# Altium project addl.PrjPcb
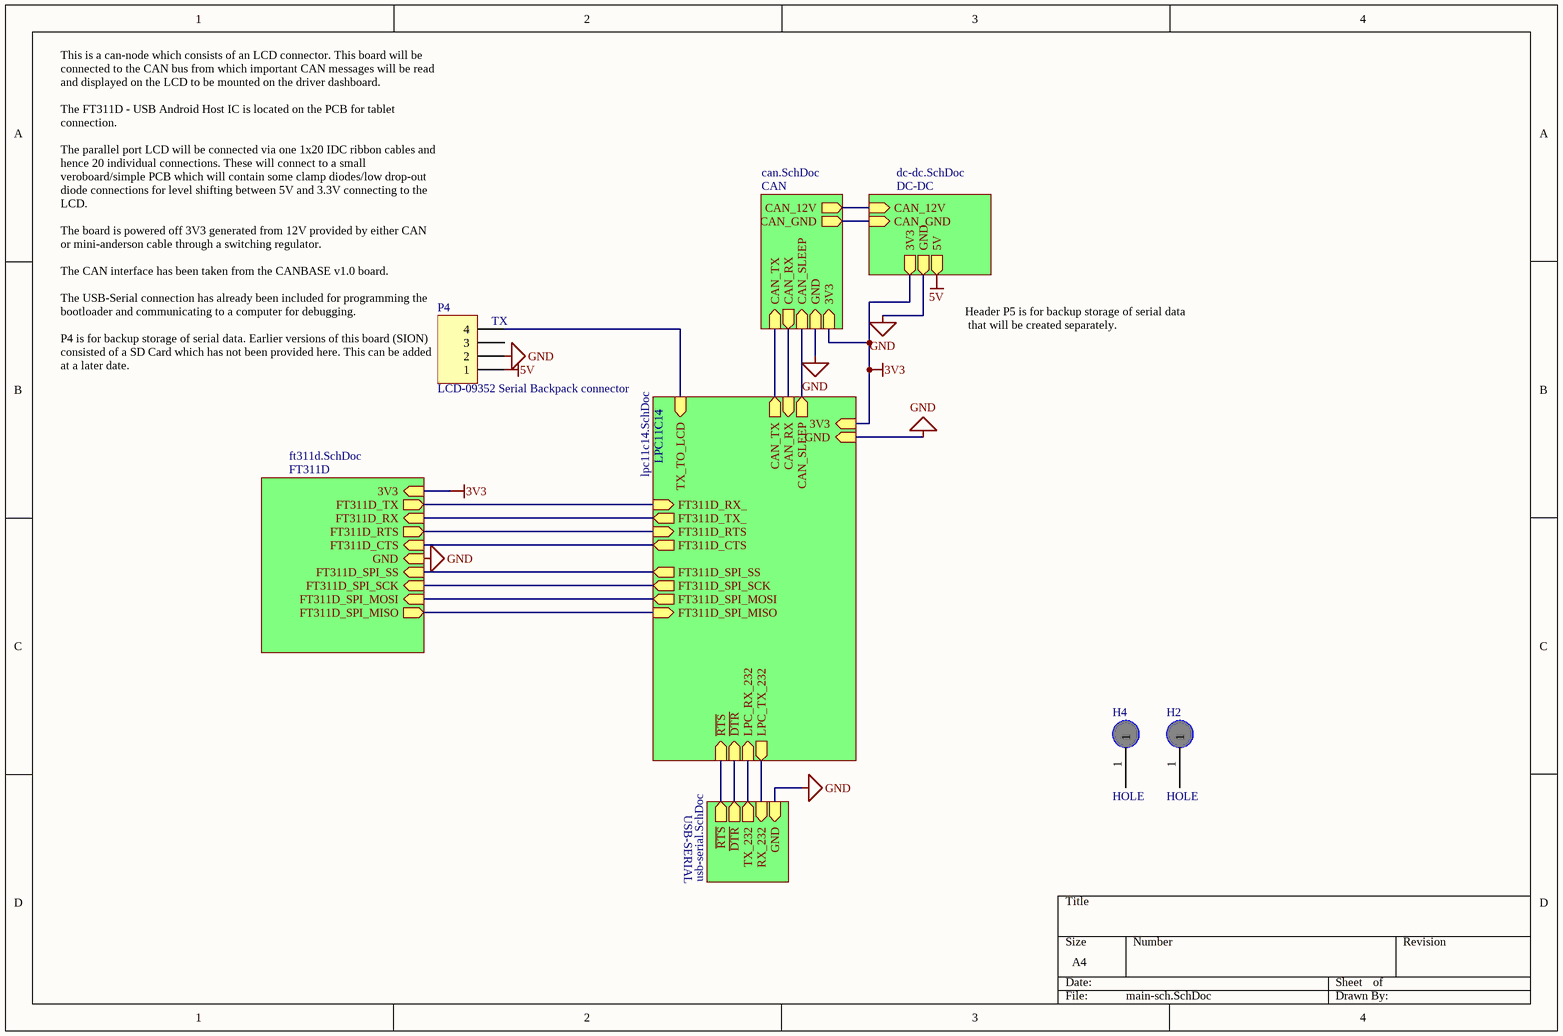
[diagram p0: main-sch.SchDoc]
6 sheets, 77 parts. Net scope: hierarchical (ports join the sheet entries above them; power ports are global).
Board files: addl.PcbDoc, addl_faceplate_left.PcbDoc, addl_faceplate_right.PcbDoc
Sheets:
  main-sch.SchDoc
    CAN = can.SchDoc
    FT311D = ft311d.SchDoc
    LPC11C14 = lpc11c14.SchDoc
    DC-DC = dc-dc.SchDoc
    USB-SERIAL = usb-serial.SchDoc

## Sheet main-sch.SchDoc
size A4

### Parts
H2  HOLE  [M2.5]
H4  HOLE  [M2.5]
P4  Header 4  [HDR1X4]  (value not drawn)

### Sub-sheets
CAN = can.SchDoc: CAN_TX (in), CAN_RX (out), 3V3 (in), GND (in), CAN_12V (out), CAN_GND (out), CAN_SLEEP (in)
DC-DC = dc-dc.SchDoc: 3V3 (out), GND (out), CAN_12V (in), 5V (out), CAN_GND (in)
FT311D = ft311d.SchDoc: FT311D_TX (out), FT311D_RX (in), FT311D_RTS (out), FT311D_CTS (in), 3V3 (in), GND (in), FT311D_SPI_SS (in), FT311D_SPI_SCK (in), FT311D_SPI_MOSI (in), FT311D_SPI_MISO (out)
LPC11C14 = lpc11c14.SchDoc: CAN_TX (out), CAN_RX (in), LPC_TX_232 (out), LPC_RX_232 (in), FT311D_RX_ (in), FT311D_TX_ (out), ~{DTR} (in), ~{RTS} (in), TX_TO_LCD (in), 3V3 (in), GND (in), FT311D_RTS (in), FT311D_CTS (out), FT311D_SPI_SS (out), FT311D_SPI_SCK (out), FT311D_SPI_MOSI (out), FT311D_SPI_MISO (in), CAN_SLEEP (out)
USB-SERIAL = usb-serial.SchDoc: RX_232 (in), TX_232 (out), ~{RTS} (out), ~{DTR} (out), GND (in)

### Nets
3V3: sheet CAN/3V3, sheet FT311D/3V3, sheet LPC11C14/3V3, sheet DC-DC/3V3
5V: P4.1 ; sheet DC-DC/5V
CAN_GND: sheet CAN/CAN_GND, sheet DC-DC/CAN_GND
GND: P4.2 ; sheet CAN/GND, sheet FT311D/GND, sheet LPC11C14/GND, sheet DC-DC/GND, sheet USB-SERIAL/GND
~{DTR}: sheet LPC11C14/~{DTR}, sheet USB-SERIAL/~{DTR}
~{RTS}: sheet LPC11C14/~{RTS}, sheet USB-SERIAL/~{RTS}
CAN_12v: sheet CAN/CAN_12V, sheet DC-DC/CAN_12V
CAN_RX: sheet CAN/CAN_RX, sheet LPC11C14/CAN_RX
CAN_TX: sheet CAN/CAN_TX, sheet LPC11C14/CAN_TX
FT311D_RX: sheet FT311D/FT311D_RX, sheet LPC11C14/FT311D_TX_
FT311D_RX_: sheet FT311D/FT311D_TX, sheet LPC11C14/FT311D_RX_
LPC_RX_232: sheet LPC11C14/LPC_RX_232, sheet USB-SERIAL/TX_232
LPC_TX_232: sheet LPC11C14/LPC_TX_232, sheet USB-SERIAL/RX_232
PIO 0.7: sheet FT311D/FT311D_CTS, sheet FT311D/FT311D_SPI_SS, sheet LPC11C14/FT311D_CTS, sheet LPC11C14/FT311D_SPI_SS
PIO 0.8/MISO0: sheet FT311D/FT311D_SPI_MISO, sheet LPC11C14/FT311D_SPI_MISO
PIO 1.5: sheet FT311D/FT311D_RTS, sheet LPC11C14/FT311D_RTS
PIO 2.1/SCK1: sheet FT311D/FT311D_SPI_SCK, sheet LPC11C14/FT311D_SPI_SCK
PIO 2.3/MOSI1: sheet FT311D/FT311D_SPI_MOSI, sheet LPC11C14/FT311D_SPI_MOSI
PIO 3.1: sheet CAN/CAN_SLEEP, sheet LPC11C14/CAN_SLEEP
TX_TO_LCD: P4.4 ; sheet LPC11C14/TX_TO_LCD

Not connected (* = marked no-connect by the designer): H2 1; H4 1; P4 3

### Notes on the sheet
- (near P4) This is a can-node which consists of an LCD connector. This board will be connected to the CAN bus from which important CAN messages will be read and displayed on the LCD to be mounted on the driver dashboard.
  The FT311D - USB Android Host IC is located on the PCB for tablet connection.
  The parallel port LCD will be connected via one 1x20 IDC ribbon cables and hence 20 individual connections. These will connect to a small veroboard/simple PCB which will contain some clamp diodes/low drop-out diode connections for level shifting between 5V and 3.3V connecting to the LCD.
  The board is powered off 3V3 generated from 12V provided by either CAN or mini-anderson cable through a switching regulator.
  The CAN interface has been taken from the CANBASE v1.0 board.
  The USB-Serial connection has already been included for programming the bootloader and communicating to a computer for debugging.
  P4 is for backup storage of serial data. Earlier versions of this board (SION) consisted of a SD Card which has not been provided here. This can be added at a later date.
- (near P4) TX
- Header P5 is for backup storage of serial data
  that will be created separately.
- (near P4) LCD-09352 Serial Backpack connector

### Library data of the parts
P4 = Header 4: Header, 4-Pin; LatestRevisionDate: 17-Jul-2002; LatestRevisionNote: Re-released for DXP Platform.; Publisher: Altium Limited

## Sheet can.SchDoc
size A4
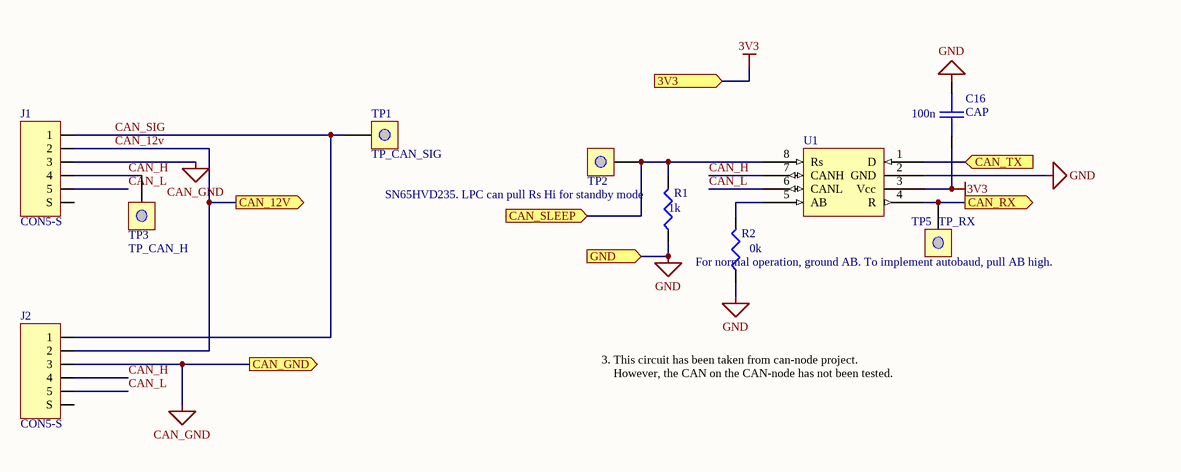
[diagram p1: can.SchDoc]

### Parts
C16  CAP  value 100n  [0603]
J1  CON5-S  [TRIAD5F]
J2  CON5-S  [TRIAD5F]
R1  value 1k  [0603]  (hidden comment: RES1)
R2  For normal operation, ground AB. To implement autobaud, pull AB high.  value 0k  [0603]
TP1  TP_CAN_SIG  [TESTPOINT]
TP2  TEST  [TESTPOINT]  (value not drawn)
TP3  TP_CAN_H  [TESTPOINT]
TP5  TP_RX  [TESTPOINT]
U1  SN65HVD235. LPC can pull Rs Hi for standby mode  [SO8]

### Ports
3V3 (in), CAN_12V (out), CAN_GND (out), CAN_RX (out), CAN_SLEEP (in), CAN_TX (in), GND (in)

### Nets
3V3: C16.2 U1.3(Vcc) ; port 3V3
CAN_GND: J1.3 J2.3 ; port CAN_GND
GND: C16.1 R1.1 R2.1 U1.2(GND) ; port GND
CAN_12v: J1.2 J2.2 ; port CAN_12V
CAN_H: J1.4 J2.4 TP3.0(TP) U1.7(CANH)
CAN_L: J1.5 J2.5 U1.6(CANL)
CAN_RX: TP5.0(TP) U1.4(R) ; port CAN_RX
CAN_SIG: J1.1 J2.1 TP1.0(TP)
CAN_TX: U1.1(D) ; port CAN_TX
PIO 3.1: R1.2 TP2.0(TP) U1.8(Rs) ; port CAN_SLEEP
NetR2_2: R2.2 U1.5(AB)

Not connected (* = marked no-connect by the designer): J1 0(S); J2 0(S)

### Notes on the sheet
- 3. This circuit has been taken from can-node project.
  However, the CAN on the CAN-node has not been tested.

### Library data of the parts
C16 = CAP: Capacitor
J1 J2 = CON5-S: Connector, 2 pin, with shield @ S
R1 R2 = RES1: Resistor
TP1 = TEST: TEST POINT for 12V on CAN
TP2 TP3 TP5 = TEST: TEST POINT
U1 = SN65HVD235: 3.3V CAN XCVR W/STANDBY

## Sheet ft311d.SchDoc
size A4
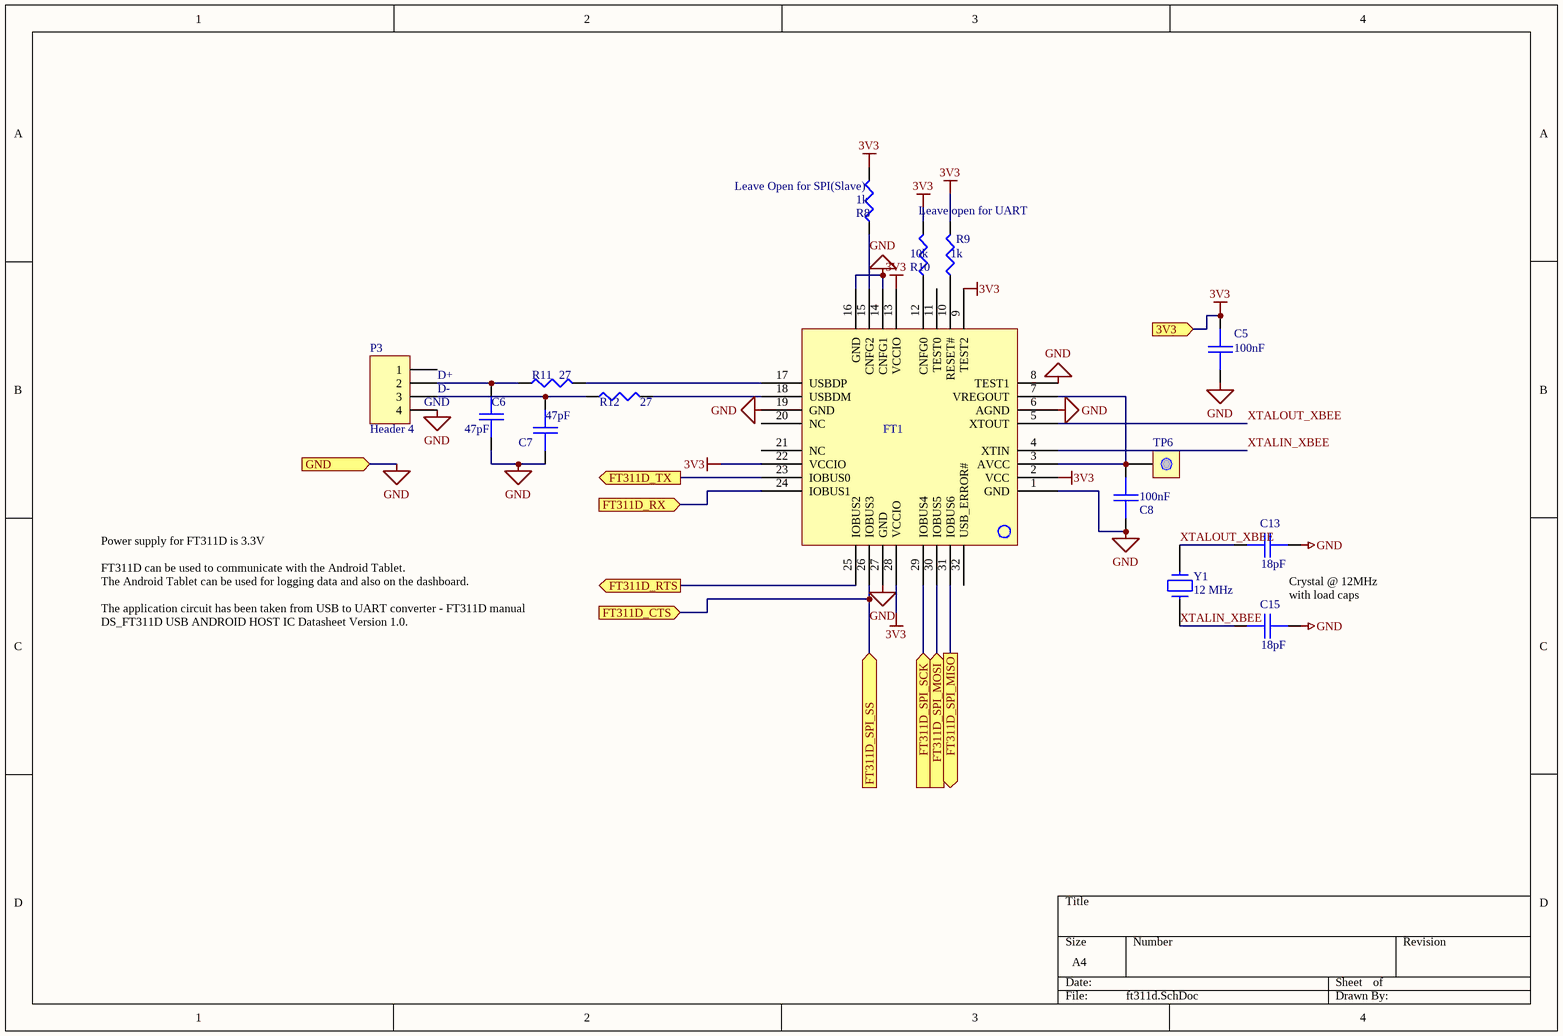
[diagram p2: ft311d.SchDoc]

### Parts
C5  value 100nF  [0603]  (hidden comment: CAP)
C6  value 47pF  [0603]  (hidden comment: CAP)
C7  value 47pF  [0603]  (hidden comment: CAP)
C8  value 100nF  [0603]  (hidden comment: CAP)
C13  value 18pF  [0603]  (hidden comment: CAP)
C15  value 18pF  [0603]  (hidden comment: CAP)
FT1  FT311D  [QFP32]  (value not drawn)
P3  Header 4  [HDR1X4]
R8  Leave Open for SPI(Slave)  value 1k  [0603]
R9  value 1k  [0603]  (hidden comment: RES1)
R10  Leave open for UART  value 10k  [0603]
R11  27  [0603]
R12  value 27  [0603]  (hidden comment: RES1)
TP6  TP_AVCC  [TESTPOINT]  (value not drawn)
Y1  12 MHz  [HC49/4H]

### Ports
3V3 (in), FT311D_CTS (in), FT311D_RTS (out), FT311D_RX (in), FT311D_SPI_MISO (out), FT311D_SPI_MOSI (in), FT311D_SPI_SCK (in), FT311D_SPI_SS (in), FT311D_TX (out), GND (in)

### Nets
3V3: C5.1 FT1.2(VCC) FT1.9(TEST2) FT1.13(VCCIO) FT1.22(VCCIO) FT1.28(VCCIO) R8.2 R9.2 R10.2 ; port 3V3
GND: C5.2 C6.2 C7.2 C8.2 C13.2 C15.2 FT1.1(GND) FT1.6(AGND) FT1.8(TEST1) FT1.14(CNFG1) FT1.16(GND) FT1.19(GND) FT1.27(GND) P3.4 ; port GND
FT311D_RX: FT1.24(IOBUS1) ; port FT311D_RX
FT311D_RX_: FT1.23(IOBUS0) ; port FT311D_TX
PIO 0.7: FT1.26(IOBUS3) ; port FT311D_CTS, port FT311D_SPI_SS
PIO 0.8/MISO0: FT1.31(IOBUS6) ; port FT311D_SPI_MISO
PIO 1.5: FT1.25(IOBUS2) ; port FT311D_RTS
PIO 2.1/SCK1: FT1.29(IOBUS4) ; port FT311D_SPI_SCK
PIO 2.3/MOSI1: FT1.30(IOBUS5) ; port FT311D_SPI_MOSI
XTALIN_XBEE: C15.1 FT1.4(XTIN) Y1.1
XTALOUT_XBEE: C13.1 FT1.5(XTOUT) Y1.2
NetC6_1: C6.1 P3.2 R11.1
NetC7_1: C7.1 P3.3 R12.1
NetC8_1: C8.1 FT1.3(AVCC) FT1.7(VREGOUT) TP6.0(TP)
NetFT1_10: FT1.10(RESET#) R9.1
NetFT1_12: FT1.12(CNFG0) R10.1
NetFT1_15: FT1.15(CNFG2) R8.1
NetFT1_17: FT1.17(USBDP) R11.2
NetFT1_18: FT1.18(USBDM) R12.2

Not connected (* = marked no-connect by the designer): FT1 11(TEST0) 20(NC) 21(NC) 32(USB_ERROR#); P3 1

### Notes on the sheet
- D+
- (near P3) GND
- D-
- Power supply for FT311D is 3.3V
  FT311D can be used to communicate with the Android Tablet.
  The Android Tablet can be used for logging data and also on the dashboard.
  The application circuit has been taken from USB to UART converter - FT311D manual
  DS_FT311D USB ANDROID HOST IC Datasheet Version 1.0.
- Crystal @ 12MHz with load caps

### Library data of the parts
C5 C8 C13 C15 = CAP: Capacitor
C6 C7 = CAP1: Capacitor
FT1 = FT311D: USB ANDROID Host IC; Manufacturer Part No: FT311D-32L1C-R-IC; Digital IC Case Style: LQFP; Farnell (09/02/2013): $6.08
P3 = Header 4: Header, 4-Pin; LatestRevisionDate: 17-Jul-2002; LatestRevisionNote: Re-released for DXP Platform.; Publisher: Altium Limited
R8-R12 = RES1: Resistor
  R11: Value: 27
TP6 = TEST: TEST POINT
Y1 = CRYSTAL: Needed?: RS; RS: 693-8803; RS Price: 0.95

## Sheet lpc11c14.SchDoc
size A4
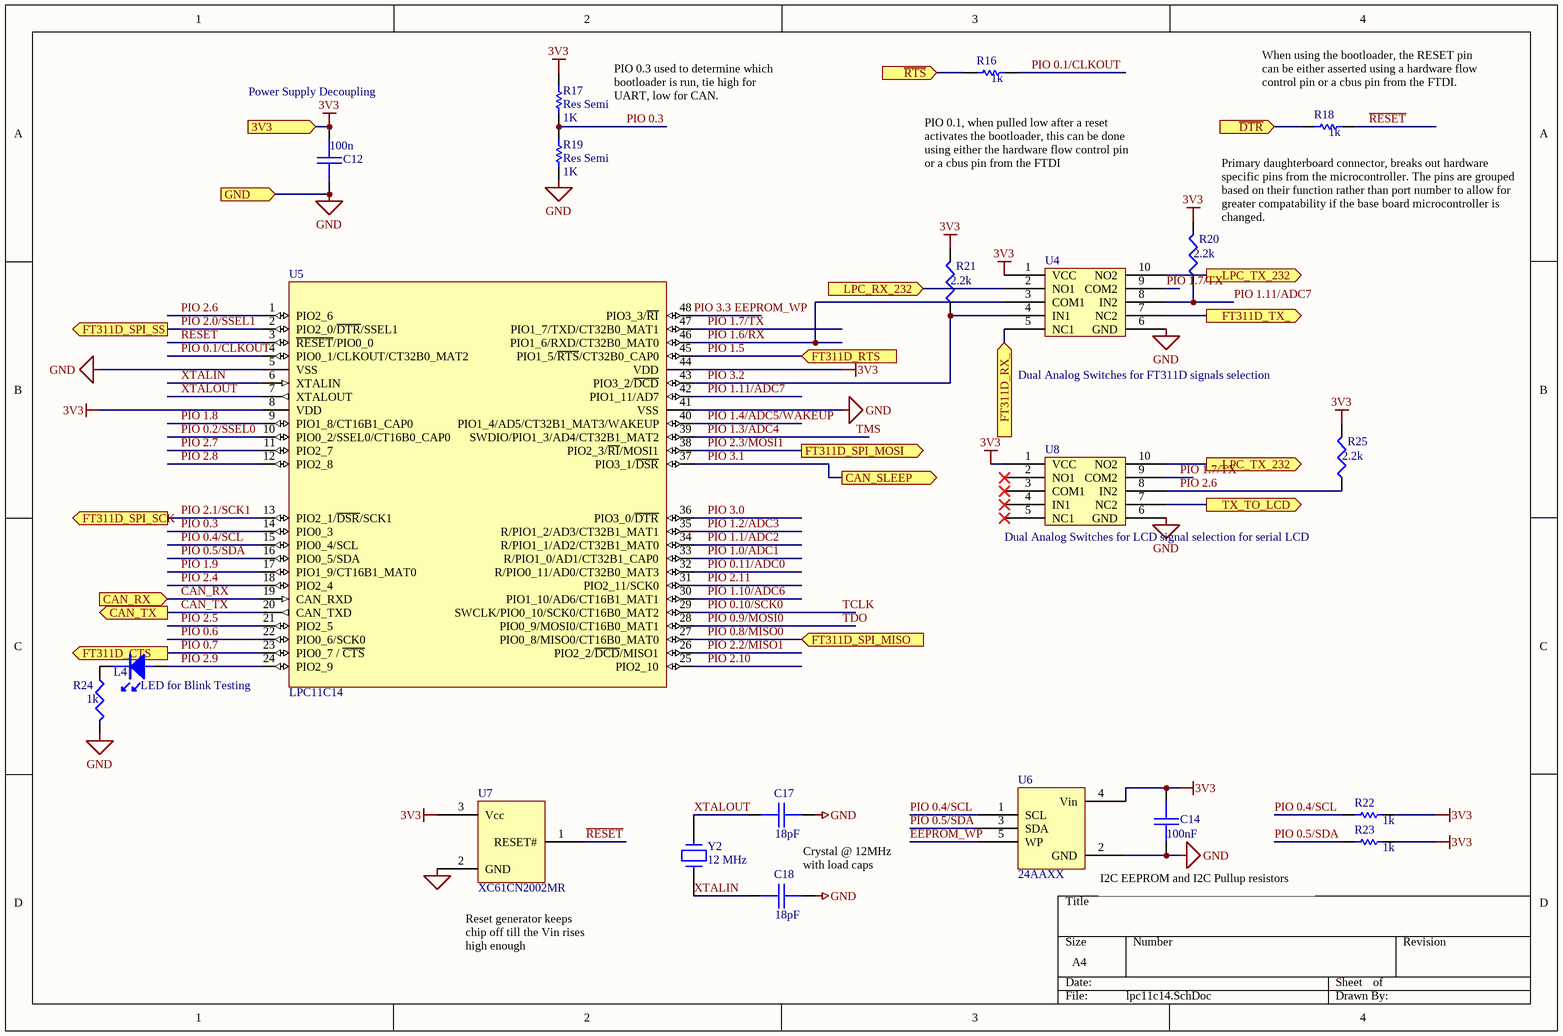
[diagram p3: lpc11c14.SchDoc]

### Parts
C12  value 100n  [0603]  (hidden comment: CAP)
C14  value 100nF  [0603]  (hidden comment: CAP)
C17  value 18pF  [0603]  (hidden comment: CAP)
C18  value 18pF  [0603]  (hidden comment: CAP)
L4  LED for Blink Testing  [0805LED]
R16  value 1k  [0603]  (hidden comment: Res Semi)
R17  Res Semi  value 1K  [0603]
R18  value 1k  [0603]  (hidden comment: Res Semi)
R19  Res Semi  value 1K  [0603]
R20  value 2.2k  [0603]  (hidden comment: RES1)
R21  value 2.2k  [0603]  (hidden comment: RES1)
R22  value 1k  [0603]  (hidden comment: Res Semi)
R23  value 1k  [0603]  (hidden comment: Res Semi)
R24  value 1k  [0603]  (hidden comment: RES1)
R25  value 2.2k  [0603]  (hidden comment: RES1)
U4  Dual Analog Switches for FT311D signals selection  [Micro10]
U5  LPC11C14  [QFP48]
U6  24AAXX  [SOT23-5]
U7  XC61CN2002MR  [SOT23-3]
U8  Dual Analog Switches for LCD signal selection for serial LCD  [Micro10]
Y2  12 MHz  [HC49/4H]

### Ports
3V3 (in), CAN_RX (in), CAN_SLEEP (out), CAN_TX (out), FT311D_CTS (out), FT311D_RTS (in), FT311D_RX_ (in), FT311D_SPI_MISO (in), FT311D_SPI_MOSI (out), FT311D_SPI_SCK (out), FT311D_SPI_SS (out), FT311D_TX_ (out), GND (in), LPC_RX_232 (in), LPC_TX_232 (out), TX_TO_LCD (out), ~{DTR} (in), ~{RTS} (in)

### Nets
3V3: C12.1 C14.1 R17.2 R20.2 R21.2 R22.2 R23.2 R25.2 U4.1(VCC) U5.8(VDD) U5.44(VDD) U6.4(Vin) U7.3(Vcc) U8.1(VCC) ; port 3V3
GND: C12.2 C14.2 C17.2 C18.2 R19.1 R24.2 U4.6(GND) U5.5(VSS) U5.41(VSS) U6.2(GND) U7.2(GND) U8.6(GND) ; port GND
~{DTR}: R18.1 ; port ~{DTR}
~{RTS}: R16.1 ; port ~{RTS}
CAN_RX: U5.19(CAN_RXD) ; port CAN_RX
CAN_TX: U5.20(CAN_TXD) ; port CAN_TX
EEPROM_WP: U5.48(PIO3_3/~{RI}) U6.5(WP)  [also labelled PIO 3.3]
FT311D_RX: U4.7(NC2) ; port FT311D_TX_
FT311D_RX_: U4.5(NC1) ; port FT311D_RX_
LPC_RX_232: U4.2(NO1) ; port LPC_RX_232
LPC_TX_232: U4.10(NO2) U8.10(NO2) ; port LPC_TX_232
PIO 0.1/CLKOUT: R16.2 U5.4(PIO0_1/CLKOUT/CT32B0_MAT2)
PIO 0.2/SSEL0: U5.10(PIO0_2/SSEL0/CT16B0_CAP0)
PIO 0.3: R17.1 R19.2 U5.14(PIO0_3)
PIO 0.4/SCL: R22.1 U5.15(PIO0_4/SCL) U6.1(SCL)
PIO 0.5/SDA: R23.1 U5.16(PIO0_5/SDA) U6.3(SDA)
PIO 0.6: U5.22(PIO0_6/SCK0)
PIO 0.7: U5.2(PIO2_0/~{DTR}/SSEL1) U5.23(PIO0_7_/_~{CTS}) ; port FT311D_CTS, port FT311D_SPI_SS  [also labelled PIO 2.0/SSEL1]
PIO 0.8/MISO0: U5.27(PIO0_8/MISO0/CT16B0_MAT0) ; port FT311D_SPI_MISO
PIO 0.9/MOSI0: U5.28(PIO0_9/MOSI0/CT16B0_MAT1)  [also labelled TDO]
PIO 0.10/SCK0: U5.29(SWCLK/PIO0_10/SCK0/CT16B0_MAT2)  [also labelled TCLK]
PIO 0.11/ADC0: U5.32(R/PIO0_11/AD0/CT32B0_MAT3)
PIO 1.0/ADC1: U5.33(R/PIO1_0/AD1/CT32B1_CAP0)
PIO 1.1/ADC2: U5.34(R/PIO1_1/AD2/CT32B1_MAT0)
PIO 1.2/ADC3: U5.35(R/PIO1_2/AD3/CT32B1_MAT1)
PIO 1.3/ADC4: U5.39(SWDIO/PIO1_3/AD4/CT32B1_MAT2)  [also labelled TMS]
PIO 1.4/ADC5/WAKEUP: U5.40(PIO1_4/AD5/CT32B1_MAT3/WAKEUP)
PIO 1.5: U5.45(PIO1_5/~{RTS}/CT32B0_CAP0) ; port FT311D_RTS
PIO 1.6/RX: U4.3(COM1) U5.46(PIO1_6/RXD/CT32B0_MAT0)
PIO 1.7/TX: U4.9(COM2) U5.47(PIO1_7/TXD/CT32B0_MAT1) U8.9(COM2)
PIO 1.8: U5.9(PIO1_8/CT16B1_CAP0)
PIO 1.9: U5.17(PIO1_9/CT16B1_MAT0)
PIO 1.10/ADC6: U5.30(PIO1_10/AD6/CT16B1_MAT1)
PIO 1.11/ADC7: R20.1 U4.8(IN2) U5.42(PIO1_11/AD7)
PIO 2.1/SCK1: U5.13(PIO2_1/~{DSR}/SCK1) ; port FT311D_SPI_SCK
PIO 2.2/MISO1: U5.26(PIO2_2/~{DCD}/MISO1)
PIO 2.3/MOSI1: U5.38(PIO2_3/~{RI}/MOSI1) ; port FT311D_SPI_MOSI
PIO 2.4: U5.18(PIO2_4)
PIO 2.5: U5.21(PIO2_5)
PIO 2.6: R25.1 U5.1(PIO2_6) U8.8(IN2)
PIO 2.7: U5.11(PIO2_7)
PIO 2.8: U5.12(PIO2_8)
PIO 2.9: L4.A U5.24(PIO2_9)
PIO 2.10: U5.25(PIO2_10)
PIO 2.11: U5.31(PIO2_11/SCK0)
PIO 3.0: U5.36(PIO3_0/~{DTR})
PIO 3.1: U5.37(PIO3_1/~{DSR}) ; port CAN_SLEEP
PIO 3.2: R21.1 U4.4(IN1) U5.43(PIO3_2/~{DCD})
~{RESET}: R18.2 U5.3(~{RESET}/PIO0_0) U7.1(RESET#)
TX_TO_LCD: U8.7(NC2) ; port TX_TO_LCD
XTALIN: C18.1 U5.6(XTALIN) Y2.1
XTALOUT: C17.1 U5.7(XTALOUT) Y2.2
NetL4_K: L4.K R24.1

Not connected (* = marked no-connect by the designer): U8 2(NO1)* 3(COM1)* 4(IN1)* 5(NC1)*

### Notes on the sheet
- (near C12) Power Supply Decoupling
- PIO 0.3 used to determine which bootloader is run, tie high for UART, low for CAN.
- (near R18) When using the bootloader, the RESET pin can be either asserted using a hardware flow control pin or a cbus pin from the FTDI.
- Text
- (near R16) PIO 0.1, when pulled low after a reset activates the bootloader, this can be done using either the hardware flow control pin or a cbus pin from the FTDI
- Primary daughterboard connector, breaks out hardware specific pins from the microcontroller. The pins are grouped based on their function rather than port number to allow for greater compatability if the base board microcontroller is changed.
- Crystal @ 12MHz with load caps
- I2C EEPROM and I2C Pullup resistors
- (near U7) Reset generator keeps chip off till the Vin rises high enough

### Library data of the parts
C12 C14 C17 C18 = CAP: Capacitor
L4 = LED
R16-R19 R22 R23 = Res Semi: Semiconductor Resistor; Published: 8-Jun-2000; LatestRevisionDate: 17-Jul-2002; LatestRevisionNote: Re-released for DXP Platform.; PackageReference: AXIAL-0.5; Publisher: Altium Limited; PackageDescription: Axial Device, Thru-Hole; 2 Leads; 0.5 in Pin Spacing
R20 R21 R24 R25 = RES1: Resistor
U4 U8 = NLAS4684: Ultra-low resistance dual SPDT Analog switch
U5 = LPC11C14_Full: NXP LPC11C14 Microcontroller; Farnell: NA
U6 = 24AAXX: I2C EEPROM for SOT23-5 package
U7 = XC61F: SOT23 reset generator; Needed?: Farnell; Farnell: 3605486; Farnell Price: 1.74
Y2 = CRYSTAL: as Y1 on sheet ft311d

## Sheet dc-dc.SchDoc
size A4
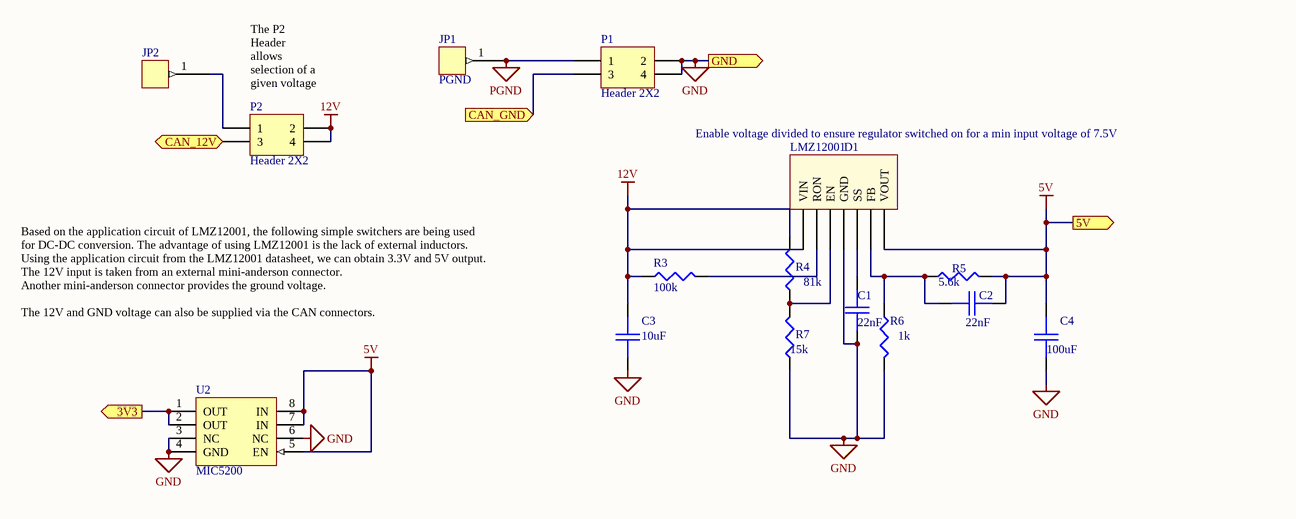
[diagram p4: dc-dc.SchDoc]

### Parts
C1  value 22nF  [0603]  (hidden comment: CAP)
C2  value 22nF  [0603]  (hidden comment: CAP)
C3  value 10uF  [1206]  (hidden comment: CAP)
C4  value 100uF  [1206]  (hidden comment: CAP)
D1  DC-DC SWITCHER  [PFM-7]  (value not drawn)
JP1  PGND  [POWERPOLE25A]
JP2  CON1  [POWERPOLE25A]  (value not drawn)
P1  Header 2X2  [HDR2X2]
P2  Header 2X2  [HDR2X2]
R3  value 100k  [0603]  (hidden comment: RES1)
R4  value 81k  [0603]  (hidden comment: RES1)
R5  value 5.6k  [0603]  (hidden comment: RES1)
R6  value 1k  [0603]  (hidden comment: RES1)
R7  value 15k  [0603]  (hidden comment: RES1)
U2  MIC5200  [SO8]

### Ports
3V3 (out), 5V (out), CAN_12V (in), CAN_GND (in), GND (out)

### Nets
3V3: U2.1(OUT) U2.2(OUT) ; port 3V3
5V: C2.2 C4.1 D1.7(VOUT) R5.2 U2.5(EN) U2.7(IN) U2.8(IN) ; port 5V
12V: C3.1 D1.1(VIN) P2.2 P2.4 R3.1 R4.2
CAN_GND: P1.3 ; port CAN_GND
GND: C1.2 C3.2 C4.2 D1.4(GND) P1.2 P1.4 R6.2 R7.1 U2.3(NC) U2.4(GND) U2.6(NC) ; port GND
PGND: JP1.1 P1.1
CAN_12v: P2.3 ; port CAN_12V
NetC1_1: C1.1 D1.5(SS)
NetC2_1: C2.1 D1.6(FB) R5.1 R6.1
NetD1_2: D1.2(RON) R3.2
NetD1_3: D1.3(EN) R4.1 R7.2
NetJP2_1: JP2.1 P2.1

### Notes on the sheet
- (near P2) The P2 Header allows selection of a given voltage
- Enable voltage divided to ensure regulator switched on for a min input voltage of 7.5V
- LMZ12001
- Based on the application circuit of LMZ12001, the following simple switchers are being used
  for DC-DC conversion. The advantage of using LMZ12001 is the lack of external inductors.
  Using the application circuit from the LMZ12001 datasheet, we can obtain 3.3V and 5V output.
  The 12V input is taken from an external mini-anderson connector.
  Another mini-anderson connector provides the ground voltage.
  The 12V and GND voltage can also be supplied via the CAN connectors.

### Library data of the parts
C1-C4 = CAP: Capacitor
D1 = lmz12001
JP1 = CON1: Power Ground (currently assumed that it is provided through a min-anderson connector)
JP2 = CON1: Currently assumed that the mini-anderson connector provides 12V
P1 P2 = Header 2X2: Header, 2-Pin, Dual row; LatestRevisionDate: 17-Jul-2002; LatestRevisionNote: Re-released for DXP Platform.; Publisher: Altium Limited
R3-R7 = RES1: Resistor
U2 = MIC5200: MIC5200 - SO8

## Sheet usb-serial.SchDoc
size A4
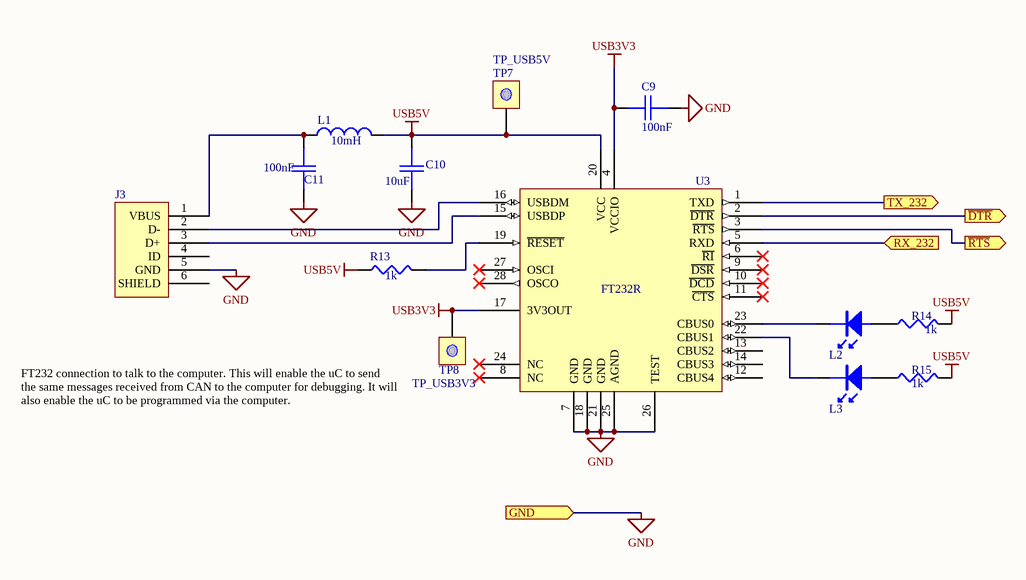
[diagram p5: usb-serial.SchDoc]

### Parts
C9  value 100nF  [0603]  (hidden comment: CAP)
C10  value 10uF  [0603]  (hidden comment: CAP)
C11  value 100nF  [0603]  (hidden comment: CAP)
J3  USB_MINIB  [USBMINIB]  (value not drawn)
L1  value 10mH  [1812]  (hidden comment: INDUCTOR)
L2  LED  [0805LED]  (value not drawn)
L3  LED  [0805LED]  (value not drawn)
R13  value 1k  [0603]  (hidden comment: RES1)
R14  value 1k  [0603]  (hidden comment: RES1)
R15  value 1k  [0603]  (hidden comment: RES1)
TP7  TP_USB5V  [TESTPOINT]
TP8  TP_USB3V3  [TESTPOINT]
U3  FT232R  [SSOP28w]

### Ports
GND (in), RX_232 (in), TX_232 (out), ~{DTR} (out), ~{RTS} (out)

### Nets
GND: C9.2 C10.1 C11.2 J3.5(GND) U3.7(GND) U3.18(GND) U3.21(GND) U3.25(AGND) U3.26(TEST) ; port GND
USB3V3: C9.1 TP8.0(TP) U3.4(VCCIO) U3.17(3V3OUT)
USB5V: C10.2 L1.2 R13.1 R14.2 R15.2 TP7.0(TP) U3.20(VCC)
~{DTR}: U3.2(~{DTR}) ; port ~{DTR}
~{RTS}: U3.3(~{RTS}) ; port ~{RTS}
LPC_RX_232: U3.1(TXD) ; port TX_232
LPC_TX_232: U3.5(RXD) ; port RX_232
NetC11_1: C11.1 J3.1(VBUS) L1.1
NetJ3_2: J3.2(D-) U3.16(USBDM)
NetJ3_3: J3.3(D+) U3.15(USBDP)
NetL2_A: L2.A R14.1
NetL2_K: L2.K U3.23(CBUS0)
NetL3_A: L3.A R15.1
NetL3_K: L3.K U3.22(CBUS1)
NetR13_2: R13.2 U3.19(~{RESET})

Not connected (* = marked no-connect by the designer): J3 4(ID) 6(SHIELD); U3 6(~{RI})* 8(NC)* 9(~{DSR})* 10(~{DCD})* 11(~{CTS})* 12(CBUS4) 13(CBUS2) 14(CBUS3) 24(NC)* 27(OSCI)* 28(OSCO)*

### Notes on the sheet
- FT232 connection to talk to the computer. This will enable the uC to send the same messages received from CAN to the computer for debugging. It will also enable the uC to be programmed via the computer.

### Library data of the parts
C9-C11 = CAP: Capacitor
J3 = USB_miniB_SMT: USB Mini B Connector; Element14: 9786473; Element14 Price: $3.08
L1 = INDUCTOR: Manufacturer: Generic Components; Class I: Passive; Revision: July-2002: Re-released for DXP Platform.; Published: 8-Jun-2000; Publisher: Altium Limited; Class II: Inductor
R13-R15 = RES1: Resistor
TP7 TP8 = TEST: TEST POINT

## Nets that join several sheets
3V3: can (C16.2 U1.3), ft311d (9 pins), lpc11c14 (14 pins), dc-dc (U2.1 U2.2)
5V: main-sch (P4.1), dc-dc (7 pins)
CAN_GND: can (J1.3 J2.3), dc-dc (P1.3)
GND: main-sch (P4.2), can (C16.1 R1.1 R2.1 U1.2), ft311d (14 pins), lpc11c14 (12 pins), dc-dc (11 pins), usb-serial (9 pins)
~{DTR}: lpc11c14 (R18.1), usb-serial (U3.2)
~{RTS}: lpc11c14 (R16.1), usb-serial (U3.3)
CAN_12v: can (J1.2 J2.2), dc-dc (P2.3)
CAN_RX: can (TP5.0 U1.4), lpc11c14 (U5.19)
CAN_TX: can (U1.1), lpc11c14 (U5.20)
FT311D_RX: ft311d (FT1.24), lpc11c14 (U4.7)
FT311D_RX_: ft311d (FT1.23), lpc11c14 (U4.5)
LPC_RX_232: lpc11c14 (U4.2), usb-serial (U3.1)
LPC_TX_232: lpc11c14 (U4.10 U8.10), usb-serial (U3.5)
PIO 0.7: ft311d (FT1.26), lpc11c14 (U5.2 U5.23)
PIO 0.8/MISO0: ft311d (FT1.31), lpc11c14 (U5.27)
PIO 1.5: ft311d (FT1.25), lpc11c14 (U5.45)
PIO 2.1/SCK1: ft311d (FT1.29), lpc11c14 (U5.13)
PIO 2.3/MOSI1: ft311d (FT1.30), lpc11c14 (U5.38)
PIO 3.1: can (R1.2 TP2.0 U1.8), lpc11c14 (U5.37)
TX_TO_LCD: main-sch (P4.4), lpc11c14 (U8.7)